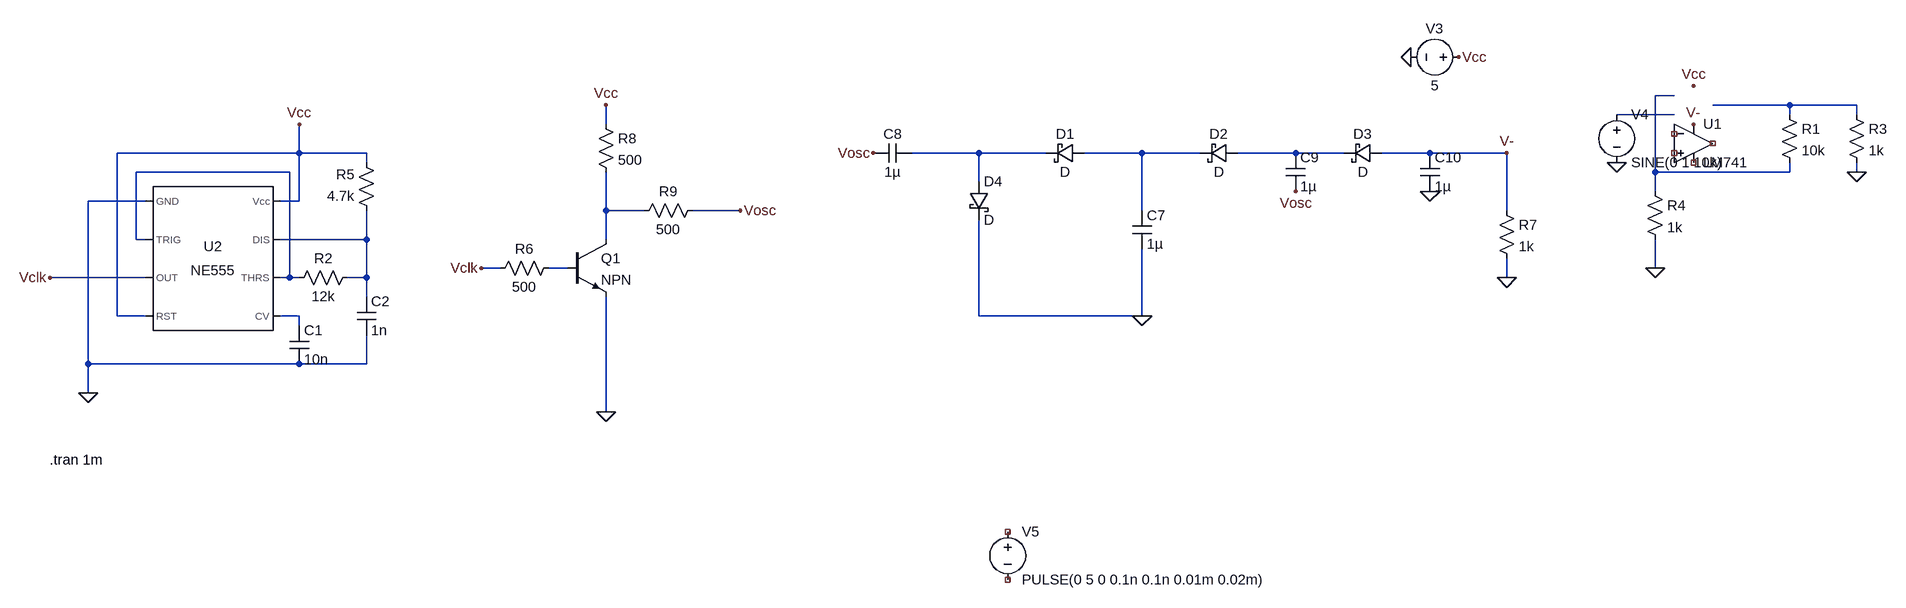
[diagram p0: schematic Lab_Project_Final.asc]
Lab_Project_Final.asc, the LTspice schematic file:
Version 4
SHEET 1 4316 736
WIRE 2896 -96 2864 -96
WIRE 3088 -80 2960 -80
WIRE 3200 -80 3088 -80
WIRE 2896 -64 2800 -64
WIRE 3088 -64 3088 -80
WIRE 3200 -64 3200 -80
WIRE 560 -48 560 -80
WIRE -208 0 -208 -48
WIRE -208 0 -512 0
WIRE -96 0 -208 0
WIRE 1600 0 1488 0
WIRE 1712 0 1600 0
WIRE 1872 0 1776 0
WIRE 1968 0 1872 0
WIRE 2128 0 2032 0
WIRE 2208 0 2128 0
WIRE 2352 0 2272 0
WIRE 2480 0 2352 0
WIRE -96 16 -96 0
WIRE -224 32 -480 32
WIRE 2864 32 2864 -96
WIRE 3088 32 3088 16
WIRE 3088 32 2864 32
WIRE 3200 32 3200 16
WIRE 1600 48 1600 0
WIRE 2864 64 2864 32
WIRE -464 80 -560 80
WIRE -208 80 -208 0
WIRE -208 80 -240 80
WIRE 560 96 560 32
WIRE 624 96 560 96
WIRE 784 96 704 96
WIRE 1872 96 1872 0
WIRE 2480 96 2480 0
WIRE -480 144 -480 32
WIRE -464 144 -480 144
WIRE -96 144 -96 96
WIRE -96 144 -240 144
WIRE 560 144 560 96
WIRE 384 192 352 192
WIRE 496 192 464 192
WIRE 2864 192 2864 144
WIRE -464 208 -624 208
WIRE -224 208 -224 32
WIRE -224 208 -240 208
WIRE -208 208 -224 208
WIRE -96 208 -96 144
WIRE -96 208 -128 208
WIRE 2480 208 2480 176
WIRE -96 240 -96 208
WIRE -512 272 -512 0
WIRE -464 272 -512 272
WIRE -208 272 -240 272
WIRE 1600 272 1600 112
WIRE 1872 272 1872 160
WIRE 1872 272 1600 272
WIRE -208 288 -208 272
WIRE -560 352 -560 80
WIRE -208 352 -560 352
WIRE -96 352 -96 304
WIRE -96 352 -208 352
WIRE -560 400 -560 352
WIRE 560 432 560 240
FLAG 1872 272 0
FLAG 2480 208 0
FLAG 2352 64 0
FLAG 2320 -160 0
FLAG 2400 -160 Vcc
FLAG 2928 -112 Vcc
FLAG 3200 32 0
FLAG 2864 192 0
FLAG 2480 0 V-
FLAG 2800 16 0
FLAG 560 -80 Vcc
FLAG 560 432 0
FLAG -208 -48 Vcc
FLAG -560 400 0
FLAG -624 208 Vclk
FLAG 784 96 Vosc
FLAG 2928 -48 V-
FLAG 352 192 Vclk
FLAG 2128 64 Vosc
FLAG 1424 0 Vosc
SYMBOL voltage 1648 624 R0
WINDOW 123 0 0 Left 0
WINDOW 39 0 0 Left 0
SYMATTR InstName V5
SYMATTR Value PULSE(0 5 0 0.1n 0.1n 0.01m 0.02m)
SYMBOL cap 1856 96 R0
SYMATTR InstName C7
SYMATTR Value 1µ
SYMBOL cap 1424 16 R270
WINDOW 0 32 32 VTop 2
WINDOW 3 0 32 VBottom 2
SYMATTR InstName C8
SYMATTR Value 1µ
SYMBOL cap 2112 0 R0
SYMATTR InstName C9
SYMATTR Value 1µ
SYMBOL res 2464 80 R0
SYMATTR InstName R7
SYMATTR Value 1k
SYMBOL cap 2336 0 R0
SYMATTR InstName C10
SYMATTR Value 1µ
SYMBOL OpAmps\\LM741 2928 -80 R0
SYMATTR InstName U1
SYMBOL voltage 2416 -160 R90
WINDOW 0 -32 56 VBottom 2
WINDOW 3 32 56 VTop 2
SYMATTR InstName V3
SYMATTR Value 5
SYMBOL res 3072 -80 R0
SYMATTR InstName R1
SYMATTR Value 10k
SYMBOL res 3184 -80 R0
SYMATTR InstName R3
SYMATTR Value 1k
SYMBOL res 2848 48 R0
SYMATTR InstName R4
SYMATTR Value 1k
SYMBOL voltage 2800 -80 R0
WINDOW 123 0 0 Left 0
WINDOW 39 0 0 Left 0
SYMATTR InstName V4
SYMATTR Value SINE(0 1 10k)
SYMBOL Misc\\NE555 -352 176 R0
SYMATTR InstName U2
SYMBOL res 544 -64 R0
SYMATTR InstName R8
SYMATTR Value 500
SYMBOL res 720 80 R90
WINDOW 0 0 56 VBottom 2
WINDOW 3 32 56 VTop 2
SYMATTR InstName R9
SYMATTR Value 500
SYMBOL res -112 192 R90
WINDOW 0 0 56 VBottom 2
WINDOW 3 32 56 VTop 2
SYMATTR InstName R2
SYMATTR Value 12k
SYMBOL res -80 112 R180
WINDOW 0 36 76 Left 2
WINDOW 3 36 40 Left 2
SYMATTR InstName R5
SYMATTR Value 4.7k
SYMBOL cap -224 288 R0
SYMATTR InstName C1
SYMATTR Value 10n
SYMBOL cap -112 240 R0
SYMATTR InstName C2
SYMATTR Value 1n
SYMBOL schottky 1776 -16 R90
WINDOW 0 0 32 VBottom 2
WINDOW 3 32 32 VTop 2
SYMATTR InstName D1
SYMBOL schottky 2032 -16 R90
WINDOW 0 0 32 VBottom 2
WINDOW 3 32 32 VTop 2
SYMATTR InstName D2
SYMBOL schottky 2272 -16 R90
WINDOW 0 0 32 VBottom 2
WINDOW 3 32 32 VTop 2
SYMATTR InstName D3
SYMBOL schottky 1584 48 R0
SYMATTR InstName D4
SYMBOL npn 496 144 R0
SYMATTR InstName Q1
SYMBOL res 480 176 R90
WINDOW 0 0 56 VBottom 2
WINDOW 3 32 56 VTop 2
SYMATTR InstName R6
SYMATTR Value 500
TEXT -624 512 Left 2 !.tran 1m

The netlist it stands for:
* Lab_Project_Final.asc
V5 NC_01 NC_02 PULSE(0 5 0 0.1n 0.1n 0.01m 0.02m)
C7 N005 0 1µ
C8 Vosc N004 1µ
C9 N006 Vosc 1µ
R7 V- 0 1k
C10 V- 0 1µ
XU1 NC_03 NC_04 V- NC_05 NC_06 LM741  ; pins In+ In- V+ V- OUT
V3 Vcc 0 5
R1 N002 N001 10k
R3 N002 0 1k
R4 N001 0 1k
V4 N003 0 SINE(0 1 10k)
XU2 0 N007 Vclk Vcc N011 N007 N009 Vcc NE555  ; pins GND TRIG OUT RST CV THRS DIS Vcc
R8 Vcc N008 500
R9 Vosc N008 500
R2 N009 N007 12k
R5 N009 Vcc 4.7k
C1 N011 0 10n
C2 N009 0 1n
D1 N005 N004 D
D2 N006 N005 D
D3 V- N006 D
D4 N004 0 D
Q1 N008 N010 0 0 NPN
R6 N010 Vclk 500
.model D D
.lib standard.dio
.model NPN NPN
.model PNP PNP
.lib standard.bjt
.tran 1m
.lib LM741.lib
.lib NE555.sub
.backanno
.end